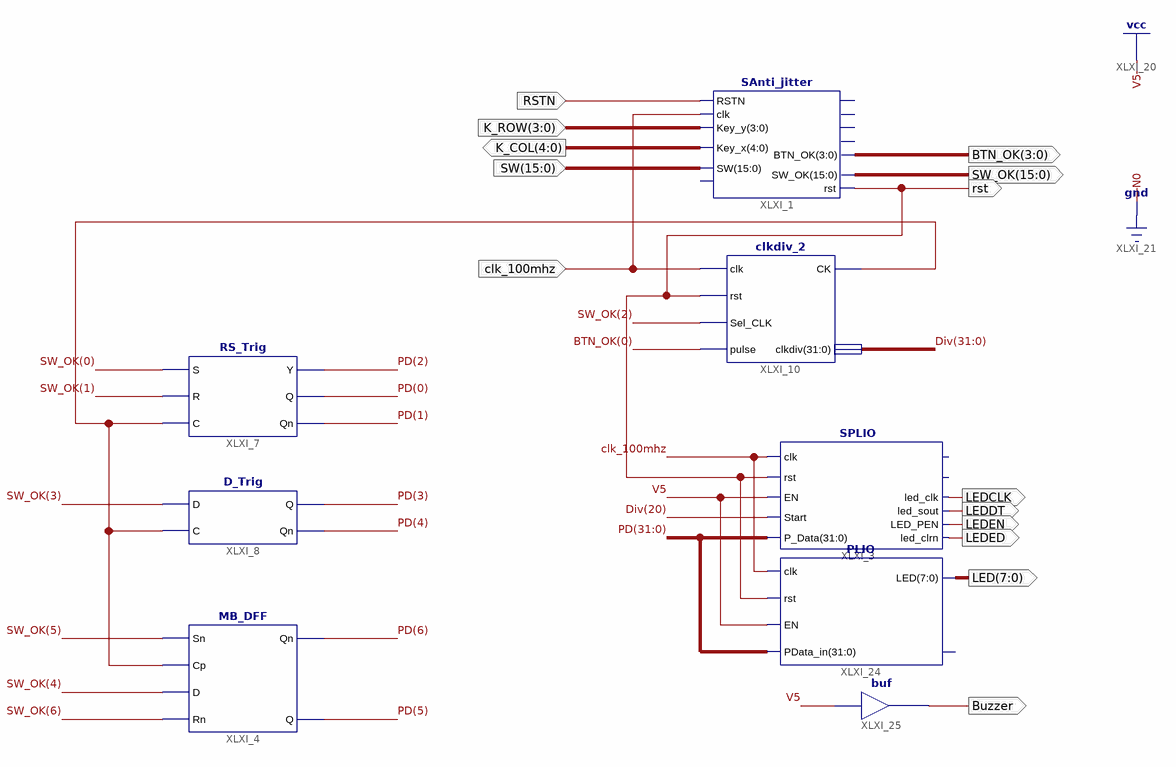
[diagram p0: schematic sheet 1]
// Xilinx ISE schematic Top_Trigger.sch (kintex7) as structural Verilog: 8 symbols, 14 ports
module Top_Trigger (
  input  RSTN,
  input  [15:0] SW,
  input  [3:0] K_ROW,
  input  clk_100mhz,
  output rst,
  output [4:0] K_COL,
  output [3:0] BTN_OK,
  output [15:0] SW_OK,
  output Buzzer,
  output LEDCLK,
  output LEDDT,
  output LEDEN,
  output LEDED,
  output [7:0] LED
);

  wire CK;
  wire [31:0] Div, PD;

  SAnti_jitter XLXI_1 (
    .SW(SW), .Key_y(K_ROW), .Key_x(K_COL), .RSTN(RSTN), .clk(clk_100mhz), .rst(rst), .SW_OK(SW_OK),
    .BTN_OK(BTN_OK));  // open: readn, Key_out, Key_ready, CR, pulse_out
  clkdiv_2 XLXI_10 (.clk(clk_100mhz), .rst(rst), .Sel_CLK(SW_OK[2]), .pulse(BTN_OK[0]), .CK(CK), .clkdiv(Div));
  MB_DFF XLXI_4 (.Sn(SW_OK[5]), .Cp(CK), .D(SW_OK[4]), .Rn(SW_OK[6]), .Qn(PD[6]), .Q(PD[5]));
  SPLIO XLXI_3 (
    .clk(clk_100mhz), .P_Data(PD), .rst(rst), .EN(1'b1), .Start(Div[20]), .led_clk(LEDCLK), .led_clrn(LEDED),
    .LED_PEN(LEDEN), .led_sout(LEDDT));  // open: LED, GPIOf0
  RS_Trig XLXI_7 (.S(SW_OK[0]), .R(SW_OK[1]), .C(CK), .Y(PD[2]), .Q(PD[0]), .Qn(PD[1]));
  D_Trig XLXI_8 (.D(SW_OK[3]), .C(CK), .Q(PD[3]), .Qn(PD[4]));
  PLIO XLXI_24 (.clk(clk_100mhz), .rst(rst), .EN(1'b1), .PData_in(PD), .LED(LED));  // open: GPIOf0
  buf XLXI_25 (Buzzer, 1'b1);
endmodule
